# EAGLE schematic FLASH (EAGLE 7.5.0)
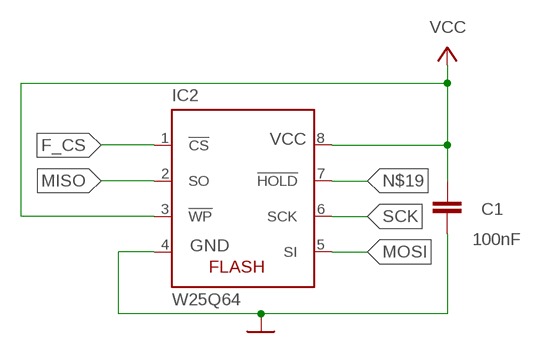
[diagram p0: schematic, sheet 1]

## Parts
C1  100nF  C-EU050-024X044  [C050-024X044]
IC2  W25Q64  25AA040P  [DIL8]

## Nets
F_CS: IC2.1(!CS)
GND: C1.1 IC2.4(GND)
MISO: IC2.2(SO)
MOSI: IC2.5(SI)
N$19: IC2.7(!HOLD)
SCK: IC2.6(SCK)
VCC: C1.2 IC2.3(!WP) IC2.8(VCC)

## Library data of the parts
C1 = rcl:C-EU: CAPACITOR, European symbol
IC2 = microchip:25*: Serial EEPROM 4K/ 8K , SPI bus; MF: MICROCHIP; MPN: 25AA040-I/P; OC_FARNELL: 1331347; OC_NEWARK: 92C7334

## Net classes
1 vcc: width 0.254 mm